# Altium project PCB_Project803.PrjPcb (part 1 of 2)
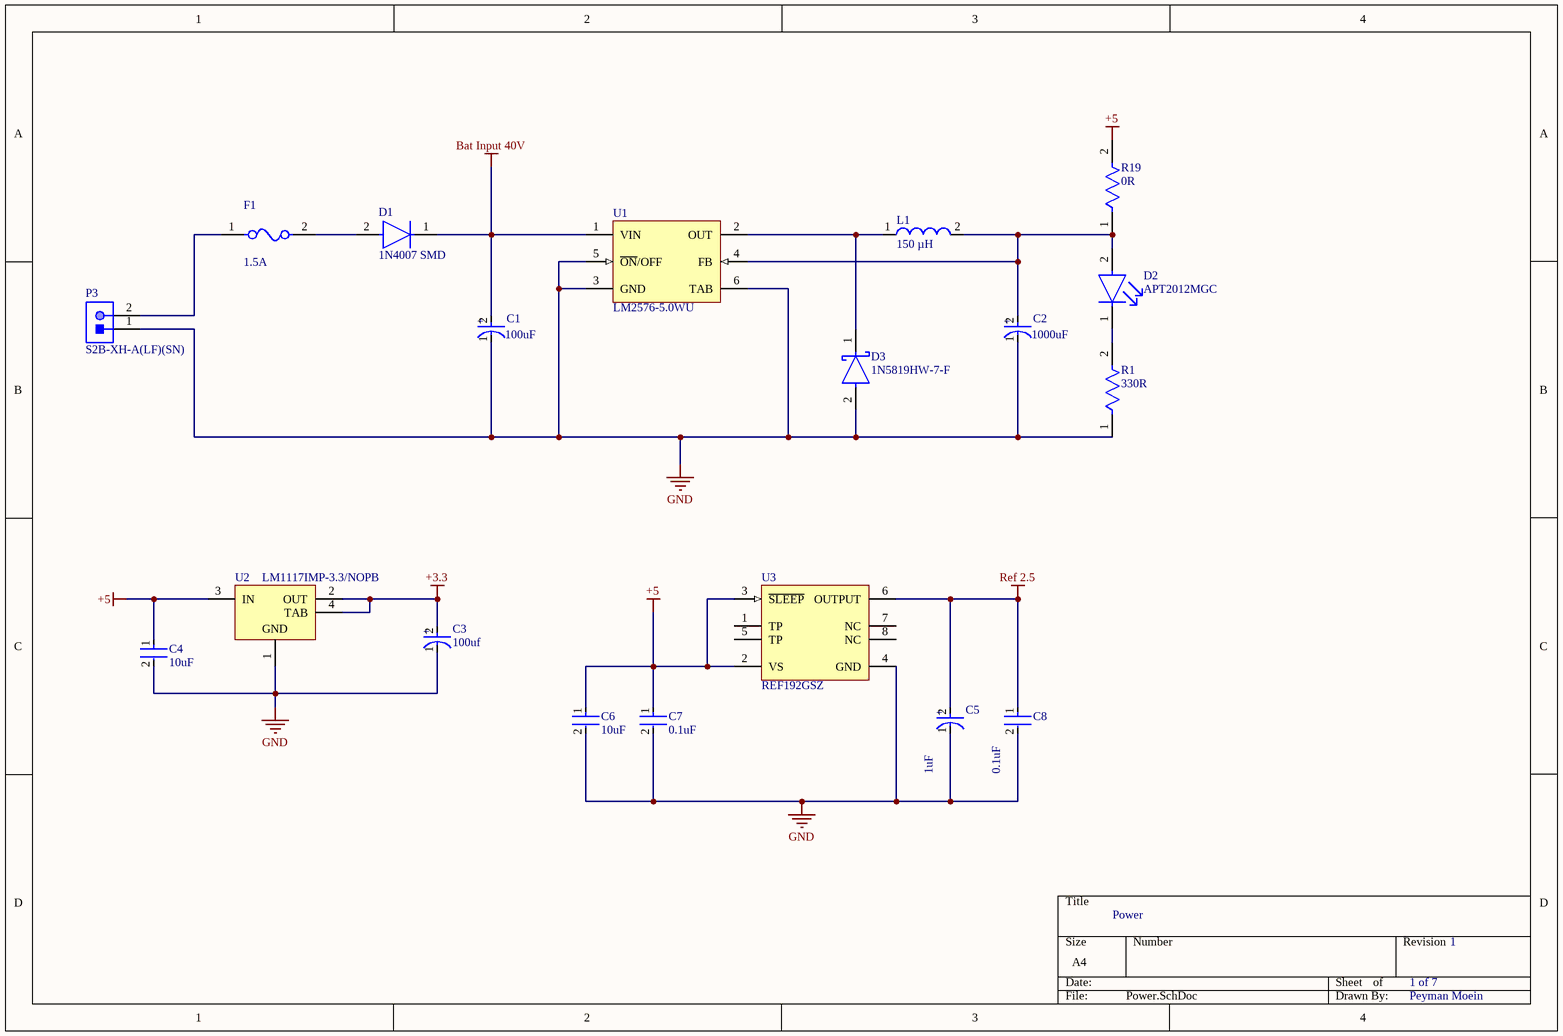
[diagram p0: Power.SchDoc]
7 sheets, 89 parts. Net scope: flat (ports and power ports of the same name join across sheets).
Board file: PCB1.PcbDoc
Sheets:
  Power.SchDoc
  Sensors.SchDoc
  GPS.SchDoc
  LoRa.SchDoc
  RealTime.SchDoc
  SD.SchDoc
  Cpu.SchDoc

## Sheet Power.SchDoc: Power
size A4; DrawnBy: Peyman Moein; Revision: 1; SheetNumber: 1; SheetTotal: 7

### Parts
C1  100uF  [FP-UWT1H101MNL1GS-MFG]
C2  1000uF  [FP-SVPF-F12-MFG]
C3  100uf  [FP-SC-MFG]
C4  10uF  [FP-GRM21B-0_1-IPC_C]
C5  1uF  [FP-T491A105K016AT-MFG]
C6  10uF  [FP-GRM21B-0_1-IPC_C]
C7  0.1uF  [FP-C0805C-DN-MFG]
C8  0.1uF  [FP-C0805C-DN-MFG]
D1  1N4007 SMD  [FP-1N4007_SMD-IPC_C]
D2  APT2012MGC  [FP-APT2012MGC-MFG]
D3  1N5819HW-7-F  [FP-SOD123-IPC_A]
F1  1.5A  [FP-0679H-MFG]
L1  150 µH  [WE-PD-XL]
P3  S2B-XH-A(LF)(SN)  [JST-S2B-XH-A(LF)(SN)_V]
R1  330R  [FP-CRCW0805-e3-MFG]
R19  0R  [FP-CRCW0805-e3-MFG]
U1  LM2576-5.0WU  [FP-TO263-5LD-PL-1-MFG]
U2  LM1117IMP-3.3/NOPB  [DCY0004A_N]
U3  REF192GSZ  [ADI-R-8_M]

### Nets
+3.3: C3.2(A) U2.2(OUT) U2.4(TAB)
+5: C4.1 C6.1 C7.1 R19.2 U2.3(IN) U3.2(VS) U3.3(~{SLEEP})
Bat Input 40V: C1.2(A) D1.1(C) U1.1(VIN)
GND: C1.1(C) C2.1(C) C3.1(C) C4.2 C5.1(C) C6.2 C7.2 C8.2 D3.2(A) P3.1 R1.1 U1.3(GND) U1.5(~{ON}/OFF) U1.6(TAB) U2.1(GND) U3.4(GND)
Ref 2.5: C5.2(A) C8.1 U3.6(OUTPUT)
NetC2_2: C2.2(A) D2.2(A) L1.2 R19.1 U1.4(FB)
NetD1_2: D1.2(A) F1.2
NetD2_1: D2.1(C) R1.2
NetD3_1: D3.1(C) L1.1 U1.2(OUT)
NetF1_1: F1.1 P3.2

Not connected (* = marked no-connect by the designer): U3 1(TP) 5(TP) 7(NC) 8(NC)

### Notes on the sheet
- Power
- 1 of 7
- 1
- Peyman Moein
- (in symbol CMP-2000-07186-2) +
- (in symbol CMP-2000-07373-2) +
- (in symbol CMP-05427-000027-1) +
- (in symbol CMP-05427-000075-1) +

### Library data of the parts
C1 = CMP-2000-07373-2: C445063; Tolerance: 20%; Voltage Rating: 50V; Leakage Current: 3uA; Ripple Current: 140mA; Life (Hours): 1000Hour; Dissipation Factor: 0.14%; Dielectric Material: Aluminium; Termination: SMD/SMT; Package Quantity: 500; Capacitance: 100uF; Height: 10mm; REACH SVHC: No SVHC; Case/Package: Radial; Series: WT; Diameter: 8mm; Construction: Cylindrical; Length: 10mm; Min Operating Temperature: -55°C; Max Operating Temperature: 105°C; Voltage Rating (DC): 50V; Packaging: Tape and Reel; Voltage: 50V; Mount: Surface Mount; Ripple Current (AC): 140mA; Radiation Hardening: No; Number of Pins: 2; Lead Free: Lead Free; Height - Seated (Max): 0.413inch; RoHS Compliant: Yes
C2 = CMP-05427-000075-1: C236289; Ripple Current (AC): 5.4A; Dissipation Factor: 12%; Life (Hours): 5000Hour; Capacitance: 1mF; Voltage: 16V; Tolerance: 20%; Leakage Current: 3.2mA; Polarity: Polar; ESR (Equivalent Series Resistance): 12mR; Lead Free: Lead Free; Ripple Current: 5.4A; Min Operating Temperature: -55°C; Radiation Hardening: No; Diameter: 10mm; Case/Package: Radial; Max Operating Temperature: 105°C; Mount: Surface Mount; Termination: SMD/SMT; Height: 12.6mm; Height - Seated (Max): 0.5inch; Package Quantity: 400; Length: 12.6mm; Packaging: Tape and Reel; Voltage Rating (DC): 16V; Voltage Rating: 16V; REACH SVHC: No SVHC; Number of Pins: 12; RoHS Compliant: Yes
C3 = CMP-05427-000027-1: C128464; Ripple Current: 300mA; Voltage: 35V; Polarity: Polar; Life (Hours): 2000Hour; Lead Diameter: 0.65mm; Tolerance: 20%; ESR (Equivalent Series Resistance): 260mR; Leakage Current: 35uA; REACH SVHC: No SVHC; Series: FT; Min Operating Temperature: -55°C; Diameter: 6.3mm; Max Operating Temperature: 105°C; Number of Pins: 2; Package Quantity: 1000; Length: 5.8mm; Lead Pitch: 1.8mm; Construction: Cylindrical; Capacitance: 100uF; Height: 5.8mm; RoHS Compliant: Yes; Packaging: Tape and Reel; Ripple Current (AC): 300mA; Height - Seated (Max): 0.24inch; Voltage Rating: 35V; Radiation Hardening: No; Contact Plating: Tin; Termination: SMD/SMT; Voltage Rating (DC): 35V; Case/Package: Radial; Mount: Surface Mount
C4 C6 = CMP-2007-03453-2: C77075; Voltage Rating (DC): 16V; Dielectric: X5R; Tolerance: 10%; Material: Ceramic; Radiation Hardening: No; Thickness: 0.053inch; Lead Free: Lead Free; Package Quantity: 1; Width: 1.25mm; Case Code (Imperial): 0805; Depth: 1.25mm; Packaging: Tape and Reel; Max Operating Temperature: 85°C; Voltage Rating: 16V; Voltage: 16V; Capacitance: 10uF; Height: 1.25mm; Case Code (Metric): 2012; Mount: Surface Mount; Case/Package: 0805; REACH SVHC: No SVHC; Length: 2mm; Min Operating Temperature: -55°C; Termination: SMD/SMT
C5 = CMP-2000-07186-2: C116269; Tolerance: 20%; Ripple Current: 87mA; Dielectric Material: Tantalum; Voltage: 16V; Life (Hours): 2000Hour; Dissipation Factor: 4%; ESR (Equivalent Series Resistance): 10R; Leakage Current: 500nA; Polarity: Polar; Lead Free: Lead Free; Capacitance: 1uF; Min Operating Temperature: -55°C; Number of Pins: 2; Mount: Surface Mount; Voltage Rating: 16V; Case Code (Imperial): 1206; Length: 3.2mm; Height: 1.6mm; Features: General Purpose; Max Operating Temperature: 125°C; Package Quantity: 1; REACH SVHC: No SVHC; Termination: SMD/SMT; Depth: 1.6mm; Width: 1.6mm; Packaging: Tape and Reel; Case Code (Metric): 3216; Case/Package: 1206; Voltage Rating (DC): 16V; Height - Seated (Max): 0.071inch
C7 C8 = CMP-2100-03606-3: C49678; Manufacturer Part Number: CC0805KRX7R9BB104; Manufacturer: Yageo; Tolerance: 0.1; Capacitance: 100 nF; Value: 100 nF; Temperature Characteristic: X7R; Voltage Rating: 50 V; Material: Ceramic; Device Class L1: Passive Components; ComponentLink2Description: Datasheet; Package: CC0805-0.85; Digikey Description: CAP CER 0.1UF 50V X7R 0805; Device Class L3: Ceramic Capacitors; Temperature: -30°C to +85°C; Height: 0.95mm; RoHS: TRUE; Ipc Land Pattern Name: CAPC200125X85; Device Class L2: Capacitors; Category: Cap; Temperature Range Low: -30°C; Temperature Range High: +85°C; Mouser Description: Multilayer Ceramic Capacitors MLCC - SMD/SMT 100nF 50V X7R 10%; Footprint Url: http://www.yageo.com/exep/pages/download/literatures/UPY-C_GEN_24.pdf; Automotive: No; Octopart: https://octopart.com/cc0805krx7r9bb104-yageo-192993; Lead Free: Yes; ComponentLink2URL: http://www.yageo.com/documents/recent/UPY-GPHC_Y5V_6.3V-to-50V_8.pdf
D1 = CMP-12389-000001-1: C727081
D2 = CMP-1426-00010-2: C138557; Forward Voltage: 1.9V; Luminous Intensity: 60mcd; Dominant Wavelength: 630nm; Forward Current: 30mA; Viewing Angle: 140°; Lens Color: Colorless; Lens Style: Clear; Test Current: 20mA; Color: Red; Lens Size: 1.25mm; Packaging: Cut Tape; Width: 1.25mm; Case Code (Metric): 2012; Max Operating Temperature: 85°C; RoHS Compliant: Yes; Mount: Surface Mount; Case/Package: 0805; Series: WL-SMCW; Length: 2mm; Case Code (Imperial): 0805; Wavelength: 630nm; Min Operating Temperature: -40°C; Lens Transparency: Clear; Package Quantity: 1; Height: 0.8mm
D3 = CMP-0303-00003-3: DIODE SCHOTTKY 40V 1A SOD123; Forward Voltage: 450mV; Capacitance: 110pF; Max Forward Surge Current (Ifsm): 25A; Peak Reverse Current: 50uA; Polarity: Standard; Element Configuration: Single; Max Power Dissipation: 450mW; Min Operating Temperature: -65°C; Package Quantity: 3000; Contact Plating: Tin; Weight: 0.000353oz; Max Repetitive Reverse Voltage (Vrrm): 40V; Max Reverse Voltage (DC): 40V; Height: 1.25mm; Average Rectified Current: 1A; Width: 1.7mm; Case/Package: SOD-123-2; Lead Free: Lead Free; Max Operating Temperature: 125°C; Current Rating: 1A; Termination: SMD/SMT; Forward Current: 1A; Radiation Hardening: No; Number of Pins: 2; Length: 2.85mm; Voltage Rating (DC): 40V; REACH SVHC: No SVHC; Peak Non-Repetitive Surge Current: 25A; Packaging: Tape and Reel; Output Current: 1A
F1 = CMP-2000-05188-2: C178994; Manufacturer Part Number: 0448005.MR; Manufacturer: Littelfuse; Max Fuse Ac Voltage: 125V; Fuse Blow Speed: Fast; Fuse Current: 5A; Fuse Interrupt Ac Current: 50A; Value: 0.01531Ω; Fuse I2T: 4.49A2Sec; Device Class L3: unset; Lead Free: Yes; RoHS: TRUE; Max Fuse Dc Voltage: 125V; Mouser Description: Fuse Chip Very Fast Acting 5A 125V SMD Solder Pad 2410 Ceramic T/R CSA/PSE/UL; Package: 0448; Device Class L2: Fuses; Device Class L1: Circuit Protection; Octopart: https://octopart.com/0448005.mr-littelfuse-672815; ComponentLink2URL: https://www.littelfuse.com/~/media/electronics/datasheets/fuses/littelfuse_fuse_448_datasheet.pdf.pdf; Automotive: No; Digikey Description: FUSE BRD MNT 5A 125VAC/VDC 2SMD; Resistance: 0.01531Ω; Fuse Interrupt Dc Current: 50A; Temperature Range High: +125°C; Temperature: -55°C to +125°C; Voltage Rating: 125V; Category: Fuse; Height: 2.94mm; ComponentLink2Description: Datasheet; Temperature Range Low: -55°C
L1 = CMP-0227-00206-1: C169397; Inductance: 150 ÂµH; PackageVersion: 2004; ComponentLink2URL: http://www.we-online.de/katalog/media/pdf/744770215.pdf; DatasheetVersion: ver 1, Jan-2006; ComponentLink1Description: Manufacturer Link; ComponentLink2Description: Datasheet; PackageDescription: SMD Inductor, 2-Leads, Body 12.0 x 12.0 mm; ComponentLink1URL: http://www.we-online.com; PackageReference: WE-PD-XL
P3 = CMP-1755-00005-1: C157931; Type (Capacitors): X7R; Voltage Rating (DC): 100 V; Tolerance: 10%; Capacitance: 1 nF; Case\Package: Radial; Min Operating Temperature: -55 degC; Mount: Through Hole; Package Quantity: 500; PackageReference: S2B-XH-A(LF)(SN); ComponentLink1Description: Manufacturer URL; Max Operating Temperature: 125 degC; ComponentLink2Description: Datasheet; RoHSCompliant: true; PackageDescription: Male Header, Pitch 2.5 mm, 1 x 2 Position, Height 6.1 mm, Tail Length 3.4 mm; REACH SVHC: No SVHC; Packaging: Bulk; Width: 3.81 mm; Length: 5.33 mm; Height: 2.54 mm; Pins: 2; Radiation Hardening: No; ComponentLink1URL: http://www.jst.com/home2.html; Lead Pitch: 2.54 mm; DatasheetVersion: May-16; Voltage Rating: 100 V; ComponentLink2URL: http://www.jst-mfg.com/product/pdf/eng/eXH.pdf
R1 = CMP-02407-004193-1: C17630; Tolerance: 1%; Resistance: 2.94R; Max Power Dissipation: 125mW; Temperature Coefficient: 100ppm/°C; Voltage Rating: 150V; Case/Package: 0805; Radiation Hardening: No; Width: 0.049inch; Packaging: Tape and Reel; Height: 0.02inch; Case Code (Imperial): 0805; Length: 2mm; Termination: SMD/SMT; Lead Free: Lead Free; Weight: 0.000194oz; Features: Automotive AEC-Q200; Min Operating Temperature: -55°C; Case Code (Metric): 2012; Contact Plating: Tin; Composition: Thick Film; Military Standard: Not; Number of Terminations: 2; Depth: 1.25mm; Package Quantity: 10; Max Operating Temperature: 155°C; Power Rating: 125mW
R19 = CMP-02407-004193-1: C25275; Tolerance: 1%; Resistance: 2.94R; Max Power Dissipation: 125mW; Temperature Coefficient: 100ppm/°C; Voltage Rating: 150V; Case/Package: 0805; Radiation Hardening: No; Width: 0.049inch; Packaging: Tape and Reel; Height: 0.02inch; Case Code (Imperial): 0805; Length: 2mm; Termination: SMD/SMT; Lead Free: Lead Free; Weight: 0.000194oz; Features: Automotive AEC-Q200; Min Operating Temperature: -55°C; Case Code (Metric): 2012; Contact Plating: Tin; Composition: Thick Film; Military Standard: Not; Number of Terminations: 2; Depth: 1.25mm; Package Quantity: 10; Max Operating Temperature: 155°C; Power Rating: 125mW
U1 = CMP-0069-00269-3: C77782; Manufacturer: Texas Instruments; PowerWise: N; CompType: Switcher; PackageTopMarking: NSUZXYTTE#*LM2596S*-5.0 P+; ComponentLink1URL: http://www.ti.com/general/docs/lit/getliterature.tsp?genericPartNumber=LM2596&fileType=pdf; PackageDescription: TO-263, Molded, .400 x .390 x .180in, 5 Lead, .067in Pitch, Surface Mount; RoHS: Y; PinCount: 5; Code_JEDEC: MO-169-AB; ComponentLink1Description: Datasheet URL; PackageReference: KTT0005B
U2 = CMP-0062-01631-4: C129334; Manufacturer: Texas Instruments; PackageTopMarking: XYTT*N05B; PowerWise: N; High-Reliability: Y; CompType: LDO IC; Code_IPC: SOT223-4; PackageReference: DCY0004A; PinCount: 4; PackageDescription: Molded SOT-223, 6.50 x 3.56 x 1.6mm Body, 4 Lead, 2.3mm Pitch; PartNumber: LM1117IMP-3.3/NOPB; RoHS: Y; ComponentLink1Description: Datasheet URL; Code_JEDEC: TO-261-AA; ComponentLink1URL: http://www.ti.com/general/docs/lit/getliterature.tsp?genericPartNumber=LM1117-N&fileType=pdf
U3 = CMP-0784-00133-1: C581299; Manufacturer: Analog Devices; Ref Out TC (ppm/C): 10; Packing: Tube; Vout: 2.5V; ComponentLink2Description: Datasheet; ComponentLink1URL: http://www.analog.com/en/index.html; PartNumber: REF192GSZ; ComponentLink4URL: Product URL:http://www.analog.com/en/special-linear-functions/voltage-references/ref192/products/product.html; ComponentLink3Description: Package Specification; PackageDescription: 8-Pin Standard Small Outline Package, Body 4.9 x 3.9 mm, Pitch 1.27 mm; ComponentLink4Description: URL Link1; Code_JEDEC: MS-012-AA; PackageReference: R-8; PackageVersion: 060506-A, 06/2006; ComponentLink2URL: http://www.analog.com/static/imported-files/data_sheets/REF19xSeries.pdf; ComponentLink1Description: Manufacturer URL; Operating Temp Range: -40 to 85 degC; DatasheetVersion: Rev. L; Mounting Technology: Surface Mount; ComponentLink3URL: http://www.analog.com/static/imported-files/packages/PKG_PDF/SOIC_Narrow%20(R)/R_8.pdf

## Sheet Sensors.SchDoc
size A4; SheetNumber: 2; SheetTotal: 7
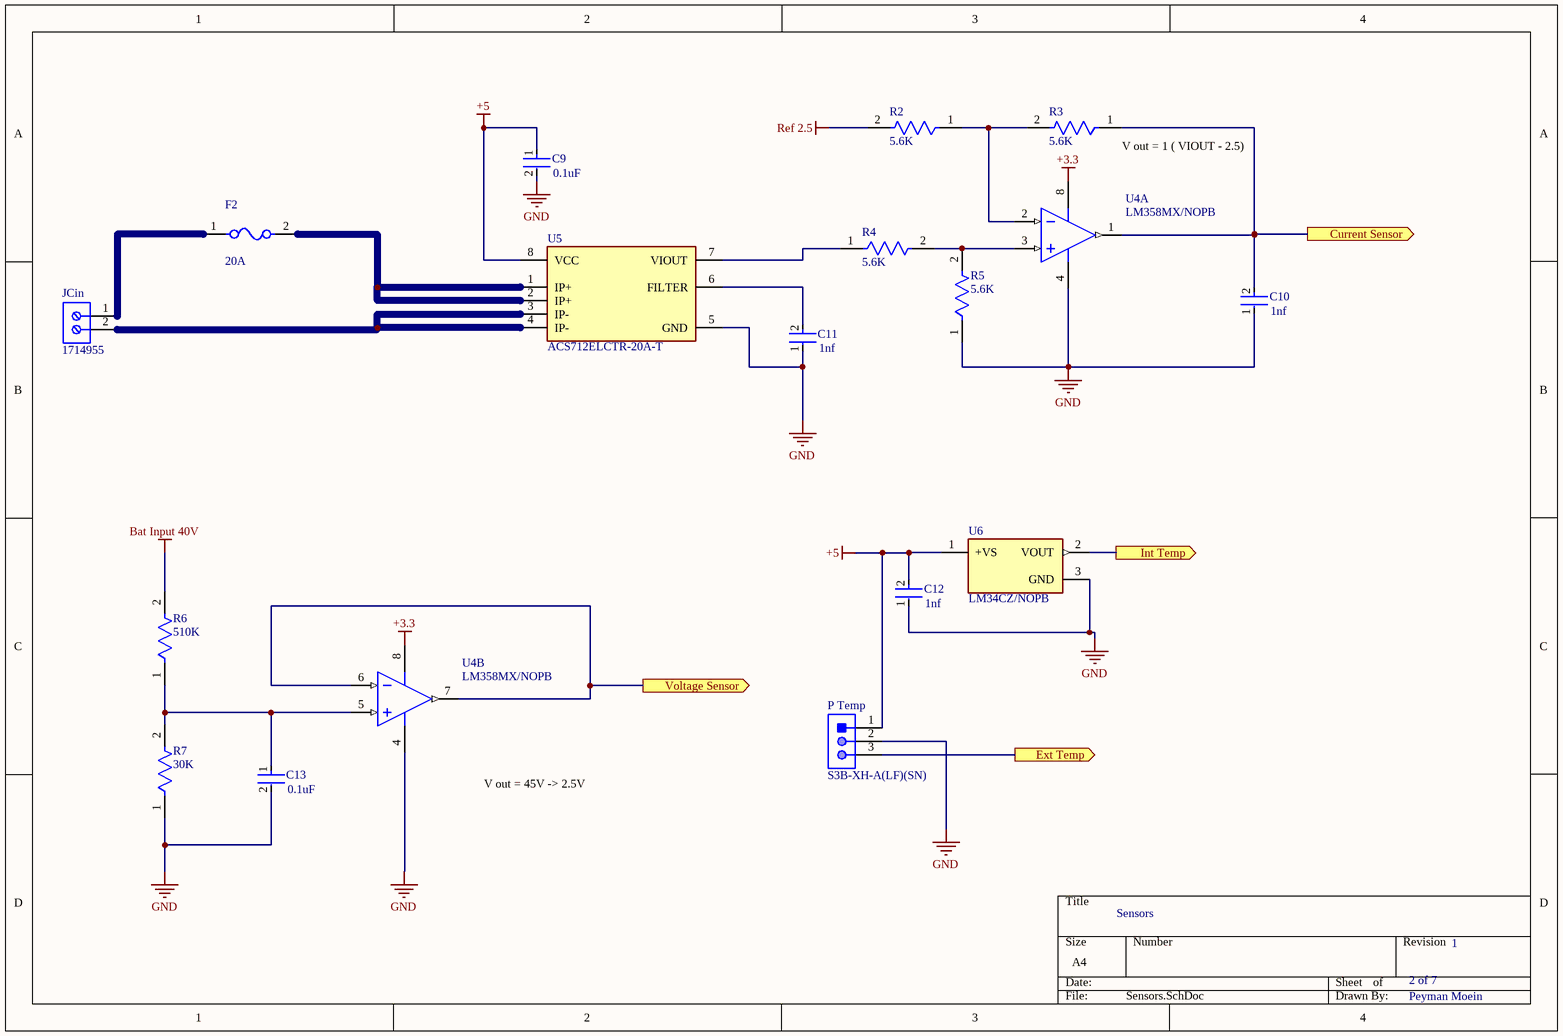
[diagram p1: Sensors.SchDoc]

### Parts
C9  0.1uF  [FP-C0805C-DN-MFG]
C10  1nf  [CAPC2013X70X45NL10T25]
C11  1nf  [CAPC2013X70X45NL10T25]
C12  1nf  [CAPC2013X70X45NL10T25]
C13  0.1uF  [FP-C0805C-DN-MFG]
F2  20A  [FP-0456-MFG]
JCin  1714955  [PHOE-1714955_V]
P_Temp  S3B-XH-A(LF)(SN)  [JST-S3B-XH-A(LF)(SN)_V]
R2  5.6K  [FP-CRCW0805-e3-MFG]
R3  5.6K  [FP-CRCW0805-e3-MFG]
R4  5.6K  [FP-CRCW0805-e3-MFG]
R5  5.6K  [FP-CRCW0805-e3-MFG]
R6  510K  [FP-CRCW0805-e3-MFG]
R7  30K  [FP-CRCW0805-e3-MFG]
U4  LM358MX/NOPB  [D0008A_L]  (parts A,B of 2)
U5  ACS712ELCTR-20A-T  [FP-LC-8-IPC_C]
U6  LM34CZ/NOPB  [FP-LP0003A-MFG]

### Ports
Current Sensor (out), Ext Temp (out), Int Temp (out), Voltage Sensor (out)

### Nets
+3.3: U4.8(V+)
+5: C9.1 C12.2 P_Temp.1 U5.8(VCC) U6.1(+VS)
Bat Input 40V: R6.2
GND: C9.2 C10.1 C11.1 C12.1 C13.2 P_Temp.2 R5.1 R7.1 U4.4(GND/V-) U5.5(GND) U6.3(GND)
Ref 2.5: R2.2
NetC10_2: C10.2 R3.1 U4.1(OUTA) ; port Current Sensor
NetC11_2: C11.2 U5.6(FILTER)
NetC13_1: C13.1 R6.1 R7.2 U4.5(+INB)
NetF2_1: F2.1 JCin.1
NetF2_2: F2.2 U5.1(IP+) U5.2(IP+)
NetJCin_2: JCin.2 U5.3(IP-) U5.4(IP-)
NetP_Temp_3: P_Temp.3 ; port Ext Temp
NetR2_1: R2.1 R3.2 U4.2(-INA)
NetR4_1: R4.1 U5.7(VIOUT)
NetR4_2: R4.2 R5.2 U4.3(+INA)
NetU4_6: U4.6(-INB) U4.7(OUTB) ; port Voltage Sensor
NetU6_2: U6.2(VOUT) ; port Int Temp

### Notes on the sheet
- (near R3) V out = 1 ( VIOUT - 2.5)
- V out = 45V -> 2.5V
- Sensors
- 2 of 7
- 1
- Peyman Moein

### Library data of the parts
C9 C13 = CMP-2100-03606-3: as C7 on sheet Power; Device Class L1: Passive Components; ComponentLink2Description: Datasheet; Package: CC0805-0.85; Digikey Description: CAP CER 0.1UF 50V X7R 0805; Device Class L3: Ceramic Capacitors; Temperature: -30°C to +85°C; Height: 0.95mm; RoHS: TRUE; Ipc Land Pattern Name: CAPC200125X85; Device Class L2: Capacitors; Category: Cap; Temperature Range Low: -30°C; Temperature Range High: +85°C; Mouser Description: Multilayer Ceramic Capacitors MLCC - SMD/SMT 100nF 50V X7R 10%; Footprint Url: http://www.yageo.com/exep/pages/download/literatures/UPY-C_GEN_24.pdf; Automotive: No; Octopart: https://octopart.com/cc0805krx7r9bb104-yageo-192993; Lead Free: Yes; ComponentLink2URL: http://www.yageo.com/documents/recent/UPY-GPHC_Y5V_6.3V-to-50V_8.pdf
C10-C12 = CMP-2100-03606-3: C303890; Manufacturer Part Number: CC0805KRX7R9BB104; Manufacturer: Yageo; Tolerance: 0.1; Capacitance: 100 nF; Value: 100 nF; Temperature Characteristic: X7R; Voltage Rating: 50 V; Material: Ceramic; Device Class L1: Passive Components; ComponentLink2Description: Datasheet; Package: CC0805-0.85; Digikey Description: CAP CER 0.1UF 50V X7R 0805; Device Class L3: Ceramic Capacitors; Temperature: -30°C to +85°C; Height: 0.95mm; RoHS: TRUE; Ipc Land Pattern Name: CAPC200125X85; Device Class L2: Capacitors; Category: Cap; Temperature Range Low: -30°C; Temperature Range High: +85°C; Mouser Description: Multilayer Ceramic Capacitors MLCC - SMD/SMT 100nF 50V X7R 10%; Footprint Url: http://www.yageo.com/exep/pages/download/literatures/UPY-C_GEN_24.pdf; Automotive: No; Octopart: https://octopart.com/cc0805krx7r9bb104-yageo-192993; Lead Free: Yes; ComponentLink2URL: http://www.yageo.com/documents/recent/UPY-GPHC_Y5V_6.3V-to-50V_8.pdf
F2 = CMP-08605-000068-1: C99552; Manufacturer: Littelfuse Inc; Manufacturer Part Number: 0456020.ER; Fuse Interrupt Dc Current: 1000A; Fuse Voltage Drop: 64.7mV; Fuse Interrupt Ac Current: 300A; Fuse I2T: 18A2Sec; Max Fuse Dc Voltage: 100V; Voltage Rating: 125V; Value: 2.3mΩ; Fuse Blow Speed: Fast; RoHS: TRUE; Lead Free: Yes; Temperature Range High: +125°C; Device Class L3: unset; Octopart: https://octopart.com/0456020.er-littelfuse-7502596; Fuse Current: 20A; Digikey Description: FUSE BOARD MNT 20A 125VAC 100VDC; Category: Fuse; Temperature Range Low: -55°C; ComponentLink2URL: https://www.littelfuse.com/~/media/electronics/datasheets/fuses/littelfuse_fuse_456_datasheet.pdf.pdf; Automotive: No; Mouser Description: Surface Mount Fuses 125V 20A V/FA NANO2; Max Fuse Ac Voltage: 125V; Temperature: -55°C to +125°C; Device Class L2: Fuses; Height: 3.05mm; Package: 0456; ComponentLink2Description: Datasheet; Device Class L1: Circuit Protection; Resistance: 2.3mΩ
JCin = CMP-2000-05797-1: PC Terminal Block, Pitch 6.35 mm, 1 x 2 Position, Height 21.5 mm, Tail Lenght 5.1 mm, RoHS, Bulk; Manufacturer: Phoenix Contact; Package Description: PC Terminal Block, Pitch 6.35 mm, 1 x 2 Position, Height 21.5 mm, Tail Lenght 5.1 mm; Datasheet URL: http://media.digikey.com/pdf/Data%20Sheets/Phoenix%20Contact%20PDFs/1714955.pdf; Package Reference: 1714955; Manufacturer URL: http://www.phoenixcontact.com/; Datasheet Version: 02/2010; Mounting Technology: ThroughHole
P_Temp = CMP-1755-00006-1: C157928; Min Supply Voltage: 1 V; Frequency: 1.8 MHz; Channels: 1; Nominal Supply Current: 170 uA; Max Power Dissipation: 1 W; Max Ouput Current: -10 mA; Case\Package: DIP; Max Supply Voltage: 15 V; Min Operating Temperature: 0 degC; Weight: 0.015535 oz; Radiation Hardening: No; ComponentLink1URL: http://www.jst.com/home2.html; PackageReference: S3B-XH-A(LF)(SN); Length: 9.81 mm; Max Operating Temperature: 70 degC; Package Quantity: 50; REACH SVHC: No SVHC; Mount: Through Hole; Pins: 8; Height: 4.57 mm; DatasheetVersion: May-16; ComponentLink1Description: Manufacturer URL; PackageDescription: Male Header, Pitch 2.5 mm, 1 x 3 Position, Height 6.1 mm, Tail Length 3.4 mm; RoHSCompliant: true; Packaging: Rail/Tube; Width: 6.35 mm; ComponentLink2URL: http://www.jst-mfg.com/product/pdf/eng/eXH.pdf; ComponentLink2Description: Datasheet
R2-R5 = CMP-02407-004193-1: C4382; Tolerance: 1%; Resistance: 2.94R; Max Power Dissipation: 125mW; Temperature Coefficient: 100ppm/°C; Voltage Rating: 150V; Case/Package: 0805; Radiation Hardening: No; Width: 0.049inch; Packaging: Tape and Reel; Height: 0.02inch; Case Code (Imperial): 0805; Length: 2mm; Termination: SMD/SMT; Lead Free: Lead Free; Weight: 0.000194oz; Features: Automotive AEC-Q200; Min Operating Temperature: -55°C; Case Code (Metric): 2012; Contact Plating: Tin; Composition: Thick Film; Military Standard: Not; Number of Terminations: 2; Depth: 1.25mm; Package Quantity: 10; Max Operating Temperature: 155°C; Power Rating: 125mW
R6 = CMP-02407-004193-1: C17724; Tolerance: 1%; Resistance: 2.94R; Max Power Dissipation: 125mW; Temperature Coefficient: 100ppm/°C; Voltage Rating: 150V; Case/Package: 0805; Radiation Hardening: No; Width: 0.049inch; Packaging: Tape and Reel; Height: 0.02inch; Case Code (Imperial): 0805; Length: 2mm; Termination: SMD/SMT; Lead Free: Lead Free; Weight: 0.000194oz; Features: Automotive AEC-Q200; Min Operating Temperature: -55°C; Case Code (Metric): 2012; Contact Plating: Tin; Composition: Thick Film; Military Standard: Not; Number of Terminations: 2; Depth: 1.25mm; Package Quantity: 10; Max Operating Temperature: 155°C; Power Rating: 125mW
R7 = CMP-02407-004193-1: C422839; Tolerance: 1%; Resistance: 2.94R; Max Power Dissipation: 125mW; Temperature Coefficient: 100ppm/°C; Voltage Rating: 150V; Case/Package: 0805; Radiation Hardening: No; Width: 0.049inch; Packaging: Tape and Reel; Height: 0.02inch; Case Code (Imperial): 0805; Length: 2mm; Termination: SMD/SMT; Lead Free: Lead Free; Weight: 0.000194oz; Features: Automotive AEC-Q200; Min Operating Temperature: -55°C; Case Code (Metric): 2012; Contact Plating: Tin; Composition: Thick Film; Military Standard: Not; Number of Terminations: 2; Depth: 1.25mm; Package Quantity: 10; Max Operating Temperature: 155°C; Power Rating: 125mW
U4 = CMP-2000-07568-1: C16416; Manufacturer: Texas Instruments; Number of Elements: 2; Gain Bandwidth Product: 1MHz; Voltage Gain: 100dB; Nominal Supply Current: 500uA; Power Dissipation: 530mW; Common Mode Rejection Ratio: 65dB; Operating Supply Voltage: 16V; Input Bias Current: 250nA; Min Supply Voltage: 3V; Slew Rate: 0.1V\/us; Min Dual Supply Voltage: 1.5V; Output Current: 30mA; Max Supply Voltage: 32V; Input Offset Voltage (Vos): 7mV; Case\/Package: SOIC; Package URL: http://www.ti.com/lit/ml/msoi002j/msoi002j.pdf; Number of Amplifiers: 2; RoHSCompliant: True; Manufacturer URL: http://www.ti.com/; Max Operating Temperature: 70degC; Unity Gain Bandwidth Product: 1MHz; Number of Channels: 2; Datasheet Version: Rev. I, 12/2014; Mount: SurfaceMount; Radiation Hardening: No; Package Description: 8-Pin Small Outline Integrated Circuit, Body 4.9 x 3.9 mm, Pitch 1.27 mm; Power Supply Rejection Ratio (PSRR): 65dB; Datasheet URL: http://www.ti.com/lit/ds/symlink/lm358-n.pdf; Packaging: TapeandReel; Max Dual Supply Voltage: 16V; REACH SVHC: NoSVHC; Number of Pins: 8; Number of Circuits: 2; Package Quantity: 2500; Mounting Technology: SurfaceMount; Min Operating Temperature: 0degC; Bandwidth: 1MHz; Package Reference: D0008A; Lead Free: LeadFree
U5 = CMP-0826-00001-2: C10681; Accuracy: 1.5%; Quiescent Current: 10mA; Response Time: 5us; Sensitivity: 100mV/A; Current Sensing: 20A; Min Supply Voltage: 4.5V; Number of Channels: 1; Polarity: Bidirectional; Frequency: 80kHz; Max Supply Current: 13mA; Operating Supply Voltage: 5V; Max Supply Voltage: 5.5V; Max Operating Temperature: 85°C; Case/Package: SOIC; REACH SVHC: No SVHC; Min Operating Temperature: -40°C; Packaging: Tape and Reel; Lead Free: Lead Free; Series: -; Length: 4.9mm; Number of Pins: 8; Linearity: 1.5%; Radiation Hardening: No; Package Quantity: 1; Termination: SMD/SMT; Output Current: 10mA; Height: 1.5mm; RoHS Compliant: Yes; Width: 3.9mm; Bandwidth: 80kHz
U6 = CMP-04948-000010-1: SENSOR ANALOG -40F-230F TO92-3; Manufacturer: Texas Instruments; Sensor Output: Analog Voltage; Operating Supply Current: 75-76uA; Min Supply Voltage: 4V; Output Current: 10mA; Output Voltage: 6V; Max Supply Voltage: 30V; Category: IC; Octopart: https://octopart.com/lm34cz%2Fnopb-texas+instruments-24813949; Temperature Range High: +110°C; Temperature Range Low: -40°C; RoHS: TRUE; Lead Free: Yes; Mouser Description: Board Mount Temperature Sensors PREC FAHRENHEIT TEMP SENSOR; Temperature: -40°C to +110°C; Package: LP0003A; Ambient Temperature Range Low: -40°F; Digikey Description: SENSOR ANALOG -40F-230F TO92-3; ComponentLink2URL: https://www.ti.com/lit/ds/symlink/lm34.pdf; ComponentLink2Description: Datasheet; Device Class L2: Temperature and Humidity Sensors; Device Class L3: unset; Device Class L1: Sensors; Ambient Temperature Range High: +230°F; Manufacturer Part Number: LM34CZ/NOPB; Automotive: No

## Sheet GPS.SchDoc
size A4; SheetNumber: 3; SheetTotal: 7
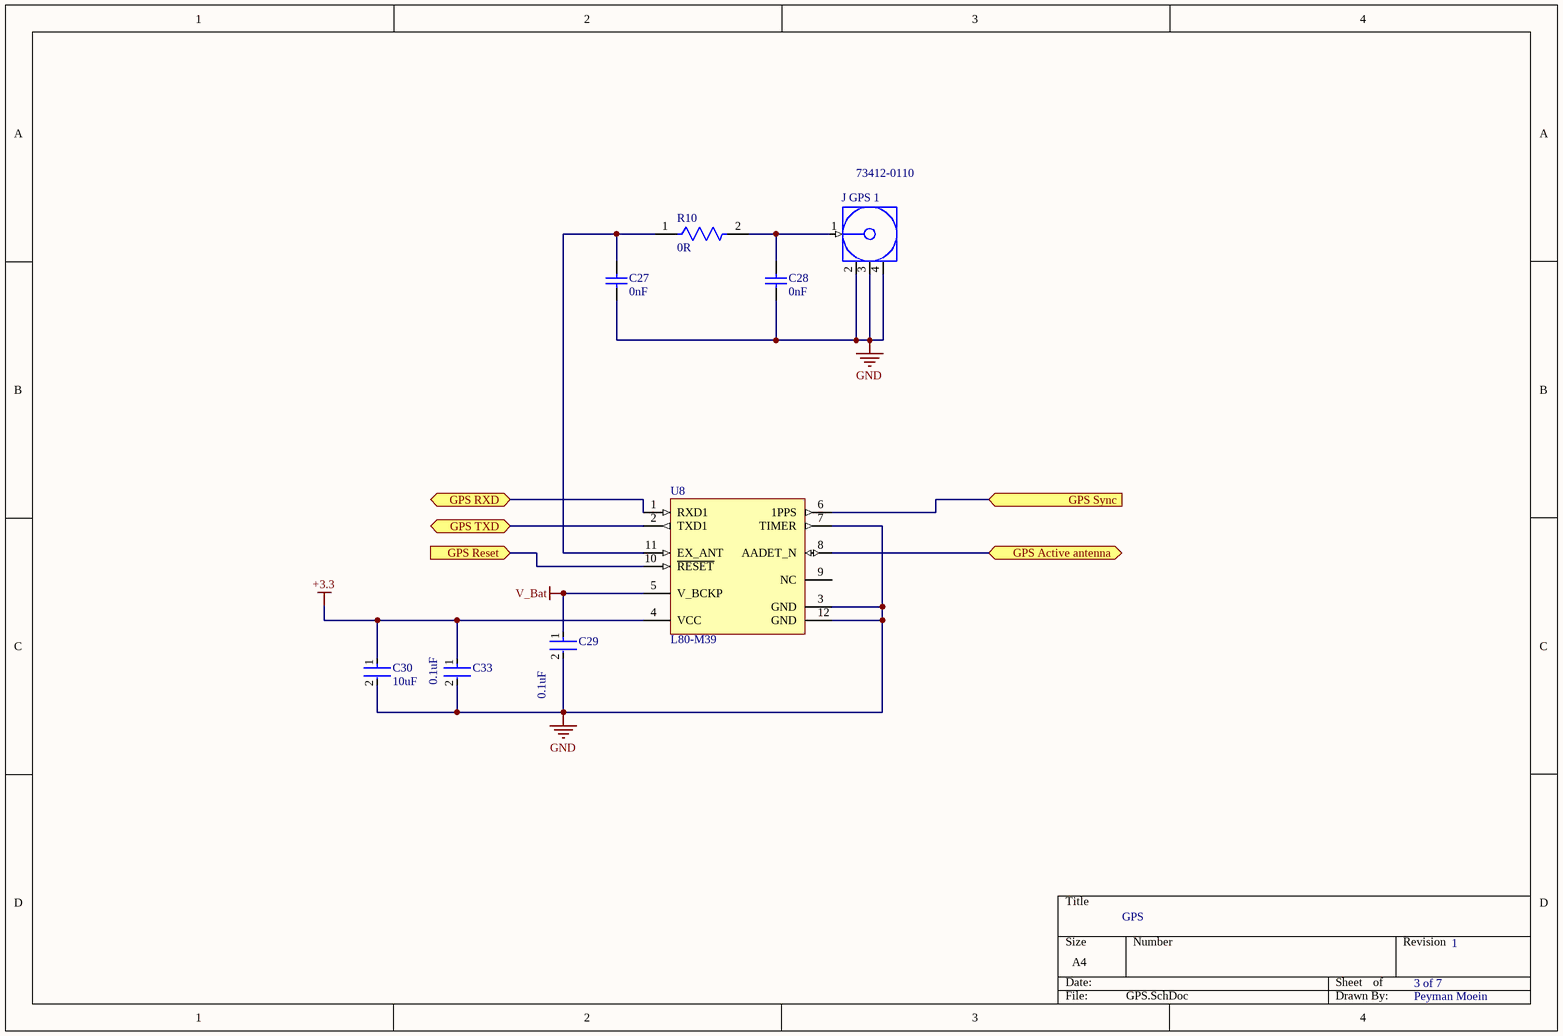
[diagram p2: GPS.SchDoc]

### Parts
C27  0nF  [CAPC2013X70X45NL10T25]
C28  0nF  [CAPC2013X70X45NL10T25]
C29  0.1uF  [FP-C0805C-DN-MFG]
C30  10uF  [FP-GRM21B-0_1-IPC_C]
C33  0.1uF  [FP-C0805C-DN-MFG]
J_GPS_1  73412-0110  [MOLX-73412-0110_V]
R10  0R  [FP-CRCW0805-e3-MFG]
U8  L80-M39  [QUEC-L80-M39-12_V]

### Ports
GPS Active antenna (bidir), GPS Reset (in), GPS RXD (bidir), GPS Sync (in), GPS TXD (bidir)

### Nets
+3.3: C30.1 C33.1 U8.4(VCC)
GND: C27.1 C28.1 C29.2 C30.2 C33.2 J_GPS_1.2(GND) J_GPS_1.3(GND) J_GPS_1.4(GND) U8.3(GND) U8.7(TIMER) U8.12(GND)
V_Bat: C29.1 U8.5(V_BCKP)
NetC27_2: C27.2 R10.1 U8.11(EX_ANT)
NetC28_2: C28.2 J_GPS_1.1(SIGNAL) R10.2
NetU7_63: U8.10(~{RESET}) ; port GPS Reset
NetU7_64: U8.6(1PPS) ; port GPS Sync
NetU7_68: U8.1(RXD1) ; port GPS RXD
NetU7_69: U8.2(TXD1) ; port GPS TXD
NetU8_8: U8.8(AADET_N) ; port GPS Active antenna

Not connected (* = marked no-connect by the designer): U8 9(NC)

### Notes on the sheet
- GPS
- 3 of 7
- 1
- Peyman Moein

### Library data of the parts
C27 C28 = CMP-2007-00866-1: Part Number: GRM2165C1H102JA01D; Manufacturer: Murata
C29 C33 = CMP-2100-03606-3: as C7 on sheet Power; Device Class L1: Passive Components; ComponentLink2Description: Datasheet; Package: CC0805-0.85; Digikey Description: CAP CER 0.1UF 50V X7R 0805; Device Class L3: Ceramic Capacitors; Temperature: -30°C to +85°C; Height: 0.95mm; RoHS: TRUE; Ipc Land Pattern Name: CAPC200125X85; Device Class L2: Capacitors; Category: Cap; Temperature Range Low: -30°C; Temperature Range High: +85°C; Mouser Description: Multilayer Ceramic Capacitors MLCC - SMD/SMT 100nF 50V X7R 10%; Footprint Url: http://www.yageo.com/exep/pages/download/literatures/UPY-C_GEN_24.pdf; Automotive: No; Octopart: https://octopart.com/cc0805krx7r9bb104-yageo-192993; Lead Free: Yes; ComponentLink2URL: http://www.yageo.com/documents/recent/UPY-GPHC_Y5V_6.3V-to-50V_8.pdf
C30 = CMP-2007-03453-2: as C4 on sheet Power; Radiation Hardening: No; Thickness: 0.053inch; Lead Free: Lead Free; Package Quantity: 1; Width: 1.25mm; Case Code (Imperial): 0805; Depth: 1.25mm; Packaging: Tape and Reel; Max Operating Temperature: 85°C; Voltage Rating: 16V; Voltage: 16V; Capacitance: 10uF; Height: 1.25mm; Case Code (Metric): 2012; Mount: Surface Mount; Case/Package: 0805; REACH SVHC: No SVHC; Length: 2mm; Min Operating Temperature: -55°C; Termination: SMD/SMT
J_GPS_1 = CMP-1676-00003-1: C411563; Voltage Rating (AC): 60 V; Mating Cycles: 30; Impedance: 50 Ohm; Frequency: 6 Hz; Gender: Female; RoHSCompliant: true; Length: 3 mm; DatasheetVersion: 04/2016; ComponentLink3URL: http://www.molex.com/pdm_docs/sd/734120110_sd.pdf; Max Operating Temperature: 90 degC; Contact Material: Bronze; Mount: Surface Mount; ComponentLink2Description: Datasheet; Packaging: Tape and Reel; Radiation Hardening: No; Voltage Rating: 60 V; Mounting Technology: Surface Mount; ComponentLink1Description: Manufacturer URL; ComponentLink1URL: http://www.molex.com/; Width: 3 mm; ComponentLink3Description: Package Specification; Package Quantity: 5000; PackageReference: 73412-0110; Min Operating Temperature: -40 degC; Height: 1.25 mm; REACH SVHC: Unknown; ComponentLink2URL: http://www.molex.com/webdocs/datasheets/pdf/en-us/0734120110_RF_COAX_CONNECTORS.pdf; Contact Plating: Gold; PackageDescription: 4-Leads SMD, Body 2.6 x 2.6 mm; PackageVersion: Rev. C14, 07/2015
R10 = CMP-02407-004193-1: as R19 on sheet Power; Case/Package: 0805; Radiation Hardening: No; Width: 0.049inch; Packaging: Tape and Reel; Height: 0.02inch; Case Code (Imperial): 0805; Length: 2mm; Termination: SMD/SMT; Lead Free: Lead Free; Weight: 0.000194oz; Features: Automotive AEC-Q200; Min Operating Temperature: -55°C; Case Code (Metric): 2012; Contact Plating: Tin; Composition: Thick Film; Military Standard: Not; Number of Terminations: 2; Depth: 1.25mm; Package Quantity: 10; Max Operating Temperature: 155°C; Power Rating: 125mW
U8 = CMP-2000-05325-1: C133488; Manufacturer: Quectel; Maximum Operating Supply Voltage: 4.3V; Maximum Operating Frequency: 1575.42MHz; Screening Level: ExtendedIndustrial; Typical Operating Supply Voltage: 3.3V; Minimum Operating Supply Voltage: 3V; Manufacturer URL: http://www.quectel.com/; Mounting: SurfaceMount; Datasheet Version: Rev. V1.1, 08/2013; Datasheet URL: http://www.quectel.com/uploadimage/downlad/l80_hardware_design_v1.1.pdf

## Sheet LoRa.SchDoc
size A4; SheetNumber: 4; SheetTotal: 7
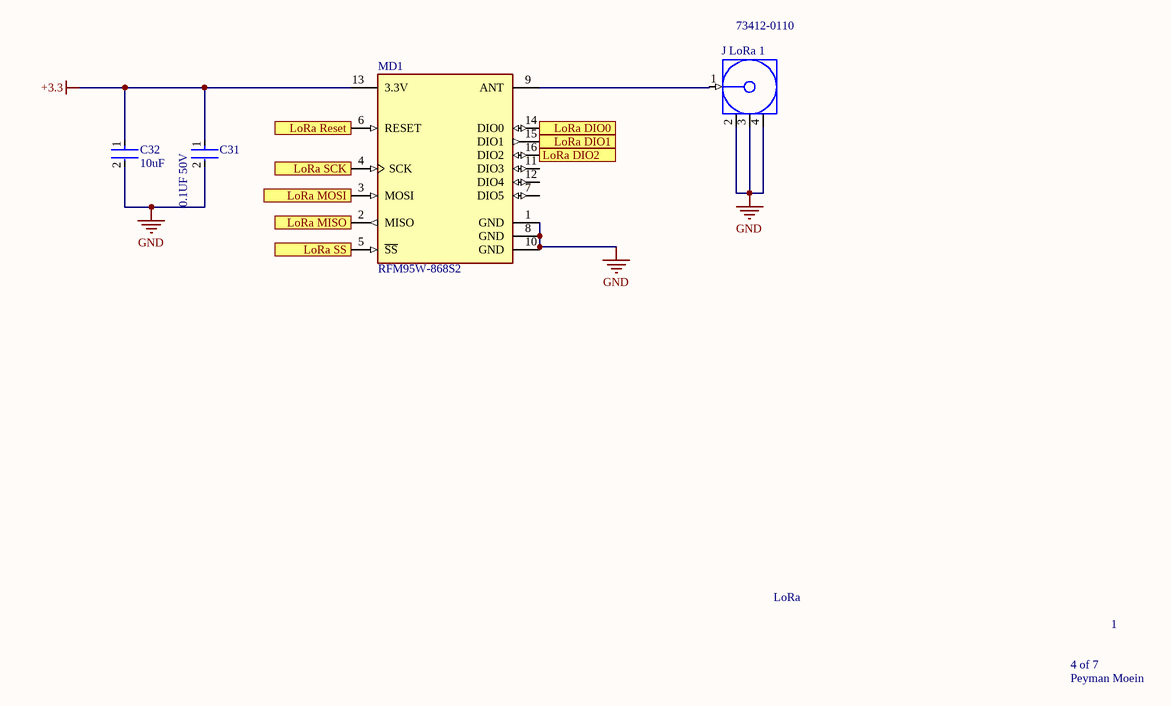
[diagram p3: LoRa.SchDoc]

### Parts
C31  0.1UF 50V  [FP-CC0805-0_85-MFG]
C32  10uF  [FP-GRM21B-0_1-IPC_C]
J_LoRa_1  73412-0110  [MOLX-73412-0110_V]
MD1  RFM95W-868S2  [FP-RFM95W-868S2-MFG]

### Ports
LoRa DIO0 (in), LoRa DIO1 (in), LoRa DIO2 (in), LoRa MISO (in), LoRa MOSI (out), LoRa Reset (in), LoRa SCK (in), LoRa SS (in)

### Nets
+3.3: C31.1 C32.1 MD1.13(3.3V)
GND: C31.2 C32.2 J_LoRa_1.2(GND) J_LoRa_1.3(GND) J_LoRa_1.4(GND) MD1.1(GND) MD1.8(GND) MD1.10(GND)
NetJ_LoRa_1_1: J_LoRa_1.1(SIGNAL) MD1.9(ANT)
NetMD1_2: MD1.2(MISO) ; port LoRa MISO
NetMD1_3: MD1.3(MOSI) ; port LoRa MOSI
NetMD1_4: MD1.4(SCK) ; port LoRa SCK
NetMD1_5: MD1.5(~{SS}) ; port LoRa SS
NetMD1_6: MD1.6(RESET) ; port LoRa Reset
NetMD1_14: MD1.14(DIO0) ; port LoRa DIO0
NetMD1_15: MD1.15(DIO1) ; port LoRa DIO1
NetMD1_16: MD1.16(DIO2) ; port LoRa DIO2

Not connected (* = marked no-connect by the designer): MD1 7(DIO5) 11(DIO3) 12(DIO4)

### Notes on the sheet
- LoRa
- 4 of 7
- 1
- Peyman Moein

### Library data of the parts
C31 = CMP-2100-03606-3: C49678; Manufacturer Part Number: CC0805KRX7R9BB104; Manufacturer: Yageo; Tolerance: 0.1; Capacitance: 100 nF; Value: 100 nF; Temperature Characteristic: X7R; Material: Ceramic; Device Class L1: Passive Components; ComponentLink2Description: Datasheet; Package: CC0805-0.85; Digikey Description: CAP CER 0.1UF 50V X7R 0805; Device Class L3: Ceramic Capacitors; Temperature: -30°C to +85°C; Voltage Rating: 50 V; Height: 0.95mm; RoHS: TRUE; Ipc Land Pattern Name: CAPC200125X85; Device Class L2: Capacitors; Category: Cap; Temperature Range Low: -30°C; Temperature Range High: +85°C; Mouser Description: Multilayer Ceramic Capacitors MLCC - SMD/SMT 100nF 50V X7R 10%; Footprint Url: http://www.yageo.com/exep/pages/download/literatures/UPY-C_GEN_24.pdf; Automotive: No; Octopart: https://octopart.com/cc0805krx7r9bb104-yageo-192993; Lead Free: Yes; ComponentLink2URL: http://www.yageo.com/documents/recent/UPY-GPHC_Y5V_6.3V-to-50V_8.pdf
C32 = CMP-2007-03453-2: as C4 on sheet Power; Radiation Hardening: No; Thickness: 0.053inch; Lead Free: Lead Free; Package Quantity: 1; Width: 1.25mm; Case Code (Imperial): 0805; Depth: 1.25mm; Packaging: Tape and Reel; Max Operating Temperature: 85°C; Voltage Rating: 16V; Voltage: 16V; Capacitance: 10uF; Height: 1.25mm; Case Code (Metric): 2012; Mount: Surface Mount; Case/Package: 0805; REACH SVHC: No SVHC; Length: 2mm; Min Operating Temperature: -55°C; Termination: SMD/SMT
J_LoRa_1 = CMP-1676-00003-1: as J_GPS_1 on sheet GPS; RoHSCompliant: true; Length: 3 mm; DatasheetVersion: 04/2016; ComponentLink3URL: http://www.molex.com/pdm_docs/sd/734120110_sd.pdf; Max Operating Temperature: 90 degC; Contact Material: Bronze; Mount: Surface Mount; ComponentLink2Description: Datasheet; Packaging: Tape and Reel; Radiation Hardening: No; Voltage Rating: 60 V; Mounting Technology: Surface Mount; ComponentLink1Description: Manufacturer URL; ComponentLink1URL: http://www.molex.com/; Width: 3 mm; ComponentLink3Description: Package Specification; Package Quantity: 5000; PackageReference: 73412-0110; Min Operating Temperature: -40 degC; Height: 1.25 mm; REACH SVHC: Unknown; ComponentLink2URL: http://www.molex.com/webdocs/datasheets/pdf/en-us/0734120110_RF_COAX_CONNECTORS.pdf; Contact Plating: Gold; PackageDescription: 4-Leads SMD, Body 2.6 x 2.6 mm; PackageVersion: Rev. C14, 07/2015
MD1 = CMP-204316-000001-1: C2844472; Data Rate: 300Kbps; Frequency: 868MHz; Sensitivity: -123dBm; Interface: SPI; Current - Transmitting: 120mA; Current - Receiving: 12.1mA; Max Operating Temperature: 70°C; Case/Package: SMD/SMT; Packaging: Bulk; Mount: Surface Mount; Min Operating Temperature: -20°C

## Sheet RealTime.SchDoc
size A4; SheetNumber: 5; SheetTotal: 7
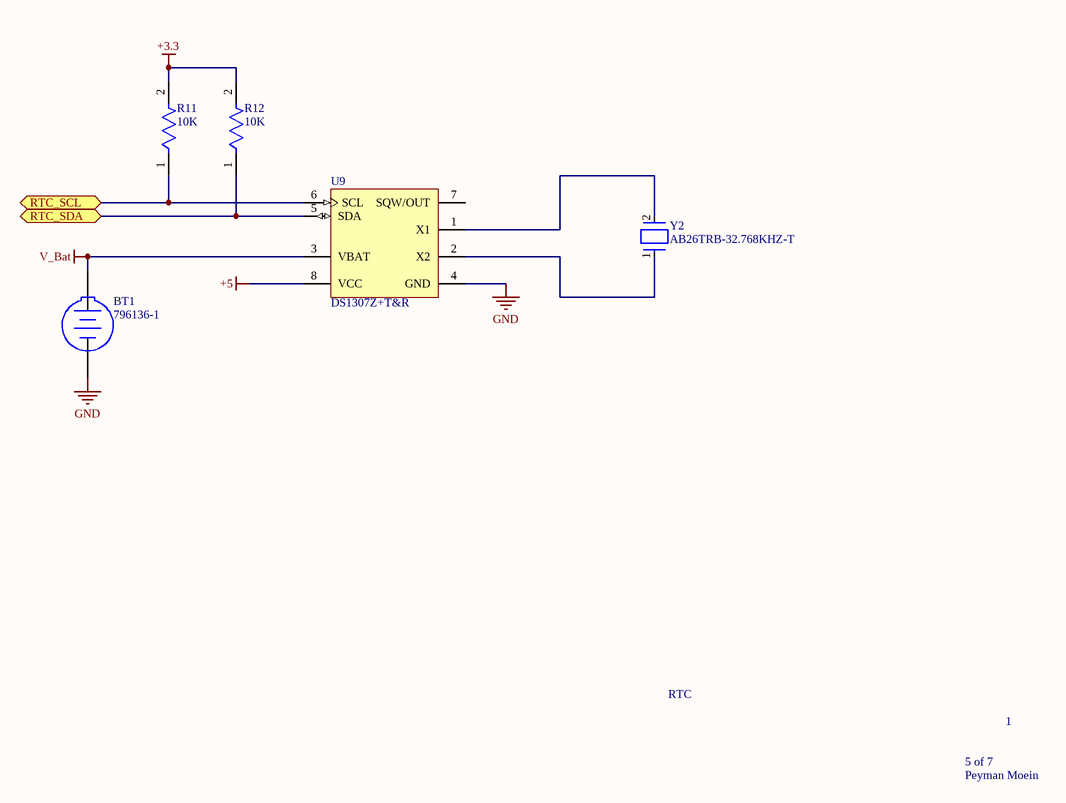
[diagram p4: RealTime.SchDoc]

### Parts
BT1  796136-1  [TECO-796136-1_V]
R11  10K  [FP-CRCW0805-e3-MFG]
R12  10K  [FP-CRCW0805-e3-MFG]
U9  DS1307Z+T&R  [S8+2_L]
Y2  AB26TRB-32.768KHZ-T  [FP-AB26TRB-MFG]

### Ports
RTC_SCL (bidir), RTC_SDA (bidir)

### Nets
+3.3: R11.2 R12.2
+5: U9.8(VCC)
GND: BT1.2(-) U9.4(GND)
V_Bat: BT1.1(+) U9.3(VBAT)
NetR11_1: R11.1 U9.6(SCL) ; port RTC_SCL
NetR12_1: R12.1 U9.5(SDA) ; port RTC_SDA
NetU9_1: U9.1(X1) Y2.2
NetU9_2: U9.2(X2) Y2.1

Not connected (* = marked no-connect by the designer): U9 7(SQW/OUT)

### Notes on the sheet
- RTC
- 5 of 7
- 1
- Peyman Moein

### Library data of the parts
BT1 = CMP-1684-00006-2: C70377; Case\Package: 0603; Lens Style: Diffused; Illumination Colour: Blue; Nominal Vf: 3.3 V; Luminous Intensity: 28 mcd; Forward Voltage: 2.8 V; Forward Current: 20 mA; Viewing Angle: 130 degrees; Pins: 2; Package Quantity: 3000; Case Code (Imperial): 0603; Colour: Blue; ComponentLink2Description: Datasheet; Packaging: Tape and Reel; Length: 1.6 mm; Max Operating Temperature: 80 degC; ComponentLink2URL: http://www.te.com/commerce/DocumentDelivery/DDEController?Action=srchrtrv&DocNm=796136&DocType=Customer+Drawing&DocLang=English&DocFormat=pdf&PartCntxt=796136-1; PackageReference: 796136-1; Case Code (Metric): 1608; PackageDescription: 2-Pin Surface Mount Device, Body 32.31 x 19.05 mm; ComponentLink1Description: Manufacturer URL; Mount: Surface Mount; ComponentLink1URL: http://www.te.com/; Min Operating Temperature: -20 degC; Width: 0.8 mm; DatasheetVersion: Dec-13; Radiation Hardening: No; RoHSCompliant: true; Height: 0.8 mm
R11 R12 = CMP-02407-004193-1: C478887; Tolerance: 1%; Resistance: 2.94R; Max Power Dissipation: 125mW; Temperature Coefficient: 100ppm/°C; Voltage Rating: 150V; Case/Package: 0805; Radiation Hardening: No; Width: 0.049inch; Packaging: Tape and Reel; Height: 0.02inch; Case Code (Imperial): 0805; Length: 2mm; Termination: SMD/SMT; Lead Free: Lead Free; Weight: 0.000194oz; Features: Automotive AEC-Q200; Min Operating Temperature: -55°C; Case Code (Metric): 2012; Contact Plating: Tin; Composition: Thick Film; Military Standard: Not; Number of Terminations: 2; Depth: 1.25mm; Package Quantity: 10; Max Operating Temperature: 155°C; Power Rating: 125mW
U9 = CMP-0254-00305-1: C9868; Code_JEDEC: MS-012-AA; Code_IPC: SOIC127P600-8; ComponentLink2Description: Datasheet; DatasheetVersion: 10-Feb-2008; ComponentLink2URL: http://datasheets.maxim-ic.com/en/ds/DS1307.pdf; PackageVersion: revC, 2010; ComponentLink1Description: Manufacturer URL; PackageDescription: 8-Pin Small-Outline IC, Narrow (0.15in), 1.27 mm Pitch, SOIC (N), Pb-Free; ComponentLink1URL: http://www.maxim-ic.com; ComponentLink3URL: http://pdfserv.maxim-ic.com/package_dwgs/21-0041.PDF; PackageReference: S8+2; ComponentLink3Description: Package Specification
Y2 = CMP-27762-006068-1: C179645; Frequency Stability: -0.034ppm; Frequency Tolerance: 20ppm; Load Capacitance: 12.5pF; Series Resistance: 50kR; Case/Package: Radial; Package Quantity: 500; Packaging: Tape and Reel; Lead Pitch: 2.54mm; Termination: Radial; Mount: Surface Mount; Frequency: 32.768kHz; Min Operating Temperature: -40°C; REACH SVHC: No SVHC; Lead Free: Lead Free; Operating Frequency: 32.768 kHz; Max Operating Temperature: 85°C; Length: 6mm; Height: 0.075inch; Depth: 1.9mm; Tolerance: 20ppm; ESR (Equivalent Series Resistance): 50kR; Number of Pins: 2; Series: AB26TRB

## Sheet SD.SchDoc
size A4; SheetNumber: 6; SheetTotal: 7
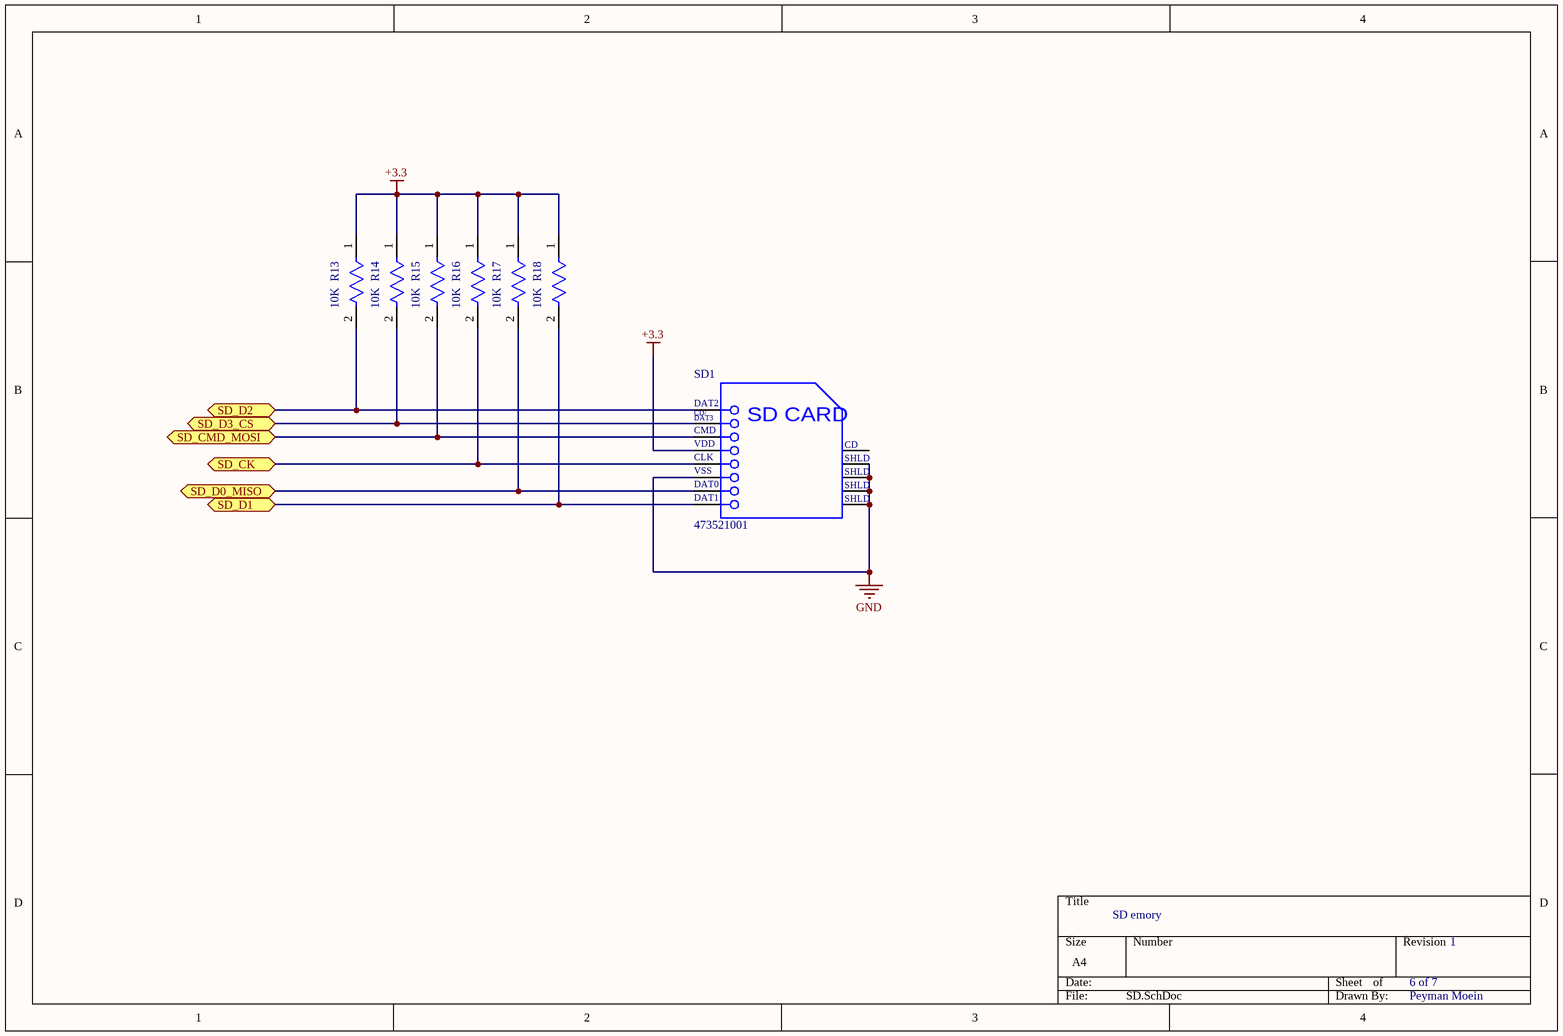
[diagram p5: SD.SchDoc]

### Parts
R13  10K  [FP-CRCW0805-e3-MFG]
R14  10K  [FP-CRCW0805-e3-MFG]
R15  10K  [FP-CRCW0805-e3-MFG]
R16  10K  [FP-CRCW0805-e3-MFG]
R17  10K  [FP-CRCW0805-e3-MFG]
R18  10K  [FP-CRCW0805-e3-MFG]
SD1  473521001  [MOLX-473521001_V]

### Ports
SD_CK (bidir), SD_CMD_MOSI (bidir), SD_D0_MISO (bidir), SD_D1 (bidir), SD_D2 (bidir), SD_D3_CS (bidir)

### Nets
+3.3: R13.1 R14.1 R15.1 R16.1 R17.1 R18.1 SD1.4(VDD)
GND: SD1.6(VSS) SD1.10(SHLD) SD1.11(SHLD) SD1.12(SHLD) SD1.13(SHLD)
NetR13_2: R13.2 SD1.1(DAT2) ; port SD_D2
NetR14_2: R14.2 SD1.2(CD/DAT3) ; port SD_D3_CS
NetR15_2: R15.2 SD1.3(CMD) ; port SD_CMD_MOSI
NetR16_2: R16.2 SD1.5(CLK) ; port SD_CK
NetR17_2: R17.2 SD1.7(DAT0) ; port SD_D0_MISO
NetR18_2: R18.2 SD1.8(DAT1) ; port SD_D1

Not connected (* = marked no-connect by the designer): SD1 9(CD)

### Notes on the sheet
- SD emory
- 6 of 7
- 1
- Peyman Moein
- (in symbol CMP-2000-05848-1) CD/; DAT3; SD CARD

### Library data of the parts
R13-R18 = CMP-02407-004193-1: as R11 on sheet RealTime; Case/Package: 0805; Radiation Hardening: No; Width: 0.049inch; Packaging: Tape and Reel; Height: 0.02inch; Case Code (Imperial): 0805; Length: 2mm; Termination: SMD/SMT; Lead Free: Lead Free; Weight: 0.000194oz; Features: Automotive AEC-Q200; Min Operating Temperature: -55°C; Case Code (Metric): 2012; Contact Plating: Tin; Composition: Thick Film; Military Standard: Not; Number of Terminations: 2; Depth: 1.25mm; Package Quantity: 10; Max Operating Temperature: 155°C; Power Rating: 125mW
SD1 = CMP-2000-05848-1: C293569; Manufacturer: Molex; Datasheet Version: Rev. G, 01/2012; Datasheet URL: http://www.molex.com/pdm_docs/sd/473521001_sd.pdf; Package Reference: 473521001; Manufacturer URL: http://www.molex.com/; Mounting Technology: SurfaceMount; Package Description: MicroSD(TM), Pitch 1.1 mm, 8 Position, Height 1.88 mm